# EAGLE design M622A (EAGLE 6.6.0)
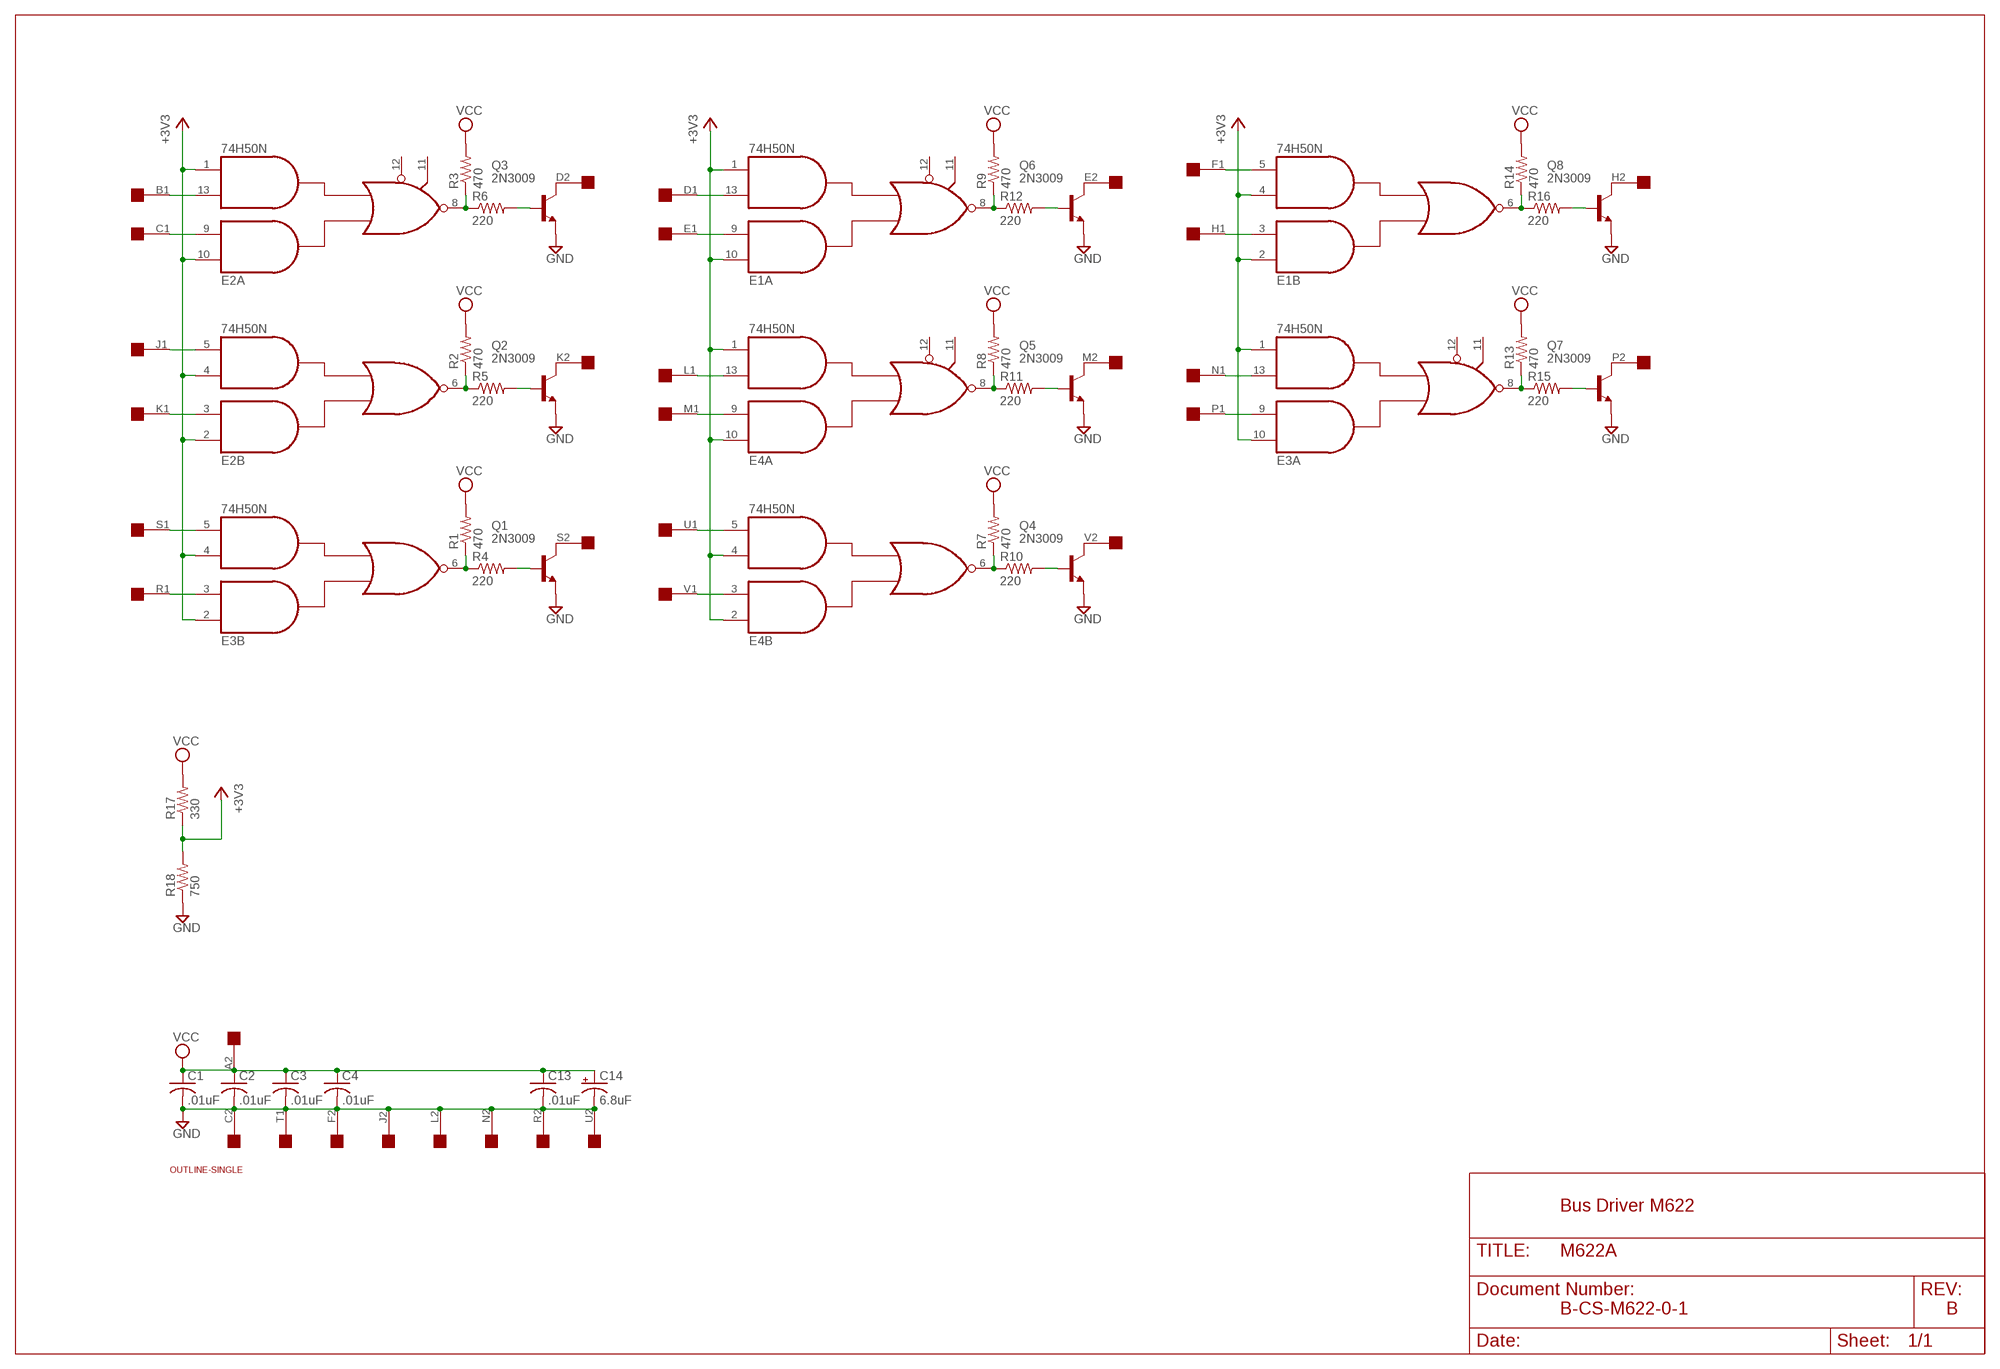
[diagram p0: schematic, sheet 1]

## Parts
C1  .01uF  C-US050-025X075  [C050-025X075]
C2  .01uF  C-US050-025X075  [C050-025X075]
C3  .01uF  C-US050-025X075  [C050-025X075]
C4  .01uF  C-US050-025X075  [C050-025X075]
C13  .01uF  C-US050-025X075  [C050-025X075]
C14  6.8uF  CPOL-USE20-8AXIAL  [E12-8]
E1  74H50N  7450N  [DIL14]
E2  74H50N  7450N  [DIL14]
E3  74H50N  7450N  [DIL14]
E4  74H50N  7450N  [DIL14]
Q1  2N3009  2N2102  [TO5]
Q2  2N3009  2N2102  [TO5]
Q3  2N3009  2N2102  [TO5]
Q4  2N3009  2N2102  [TO5]
Q5  2N3009  2N2102  [TO5]
Q6  2N3009  2N2102  [TO5]
Q7  2N3009  2N2102  [TO5]
Q8  2N3009  2N2102  [TO5]
R1  470  R-US_0207/10  [0207/10]
R2  470  R-US_0207/10  [0207/10]
R3  470  R-US_0207/10  [0207/10]
R4  220  R-US_0207/10  [0207/10]
R5  220  R-US_0207/10  [0207/10]
R6  220  R-US_0207/10  [0207/10]
R7  470  R-US_0207/10  [0207/10]
R8  470  R-US_0207/10  [0207/10]
R9  470  R-US_0207/10  [0207/10]
R10  220  R-US_0207/10  [0207/10]
R11  220  R-US_0207/10  [0207/10]
R12  220  R-US_0207/10  [0207/10]
R13  470  R-US_0207/10  [0207/10]
R14  470  R-US_0207/10  [0207/10]
R15  220  R-US_0207/10  [0207/10]
R16  220  R-US_0207/10  [0207/10]
R17  330  R-US_0207/10  [0207/10]
R18  750  R-US_0207/10  [0207/10]
U$1  SINGLE  [EDGE-CON2]
U$4  OUTLINE-SINGLE  [SINGLE]

## Nets
+3V3 [Supply]: E1.1(A:I4) E1.2(B:I1) E1.4(B:I3) E1.10(A:I1) E2.1(A:I4) E2.2(B:I1) E2.4(B:I3) E2.10(A:I1) E3.1(A:I4) E3.2(B:I1) E3.4(B:I3) E3.10(A:I1) E4.1(A:I4) E4.2(B:I1) E4.4(B:I3) E4.10(A:I1) R17.1 R18.2
GND [Supply]: C1.2 C2.2 C3.2 C4.2 C13.2 C14.- Q1.1(E) Q2.1(E) Q3.1(E) Q4.1(E) Q5.1(E) Q6.1(E) Q7.1(E) Q8.1(E) R18.1 U$1.C2 U$1.F2 U$1.J2 U$1.L2 U$1.N2 U$1.R2 U$1.T1 U$1.U2
N$1: E2.3(B:I2) U$1.K1
N$2: E2.5(B:I4) U$1.J1
N$3: E2.9(A:I2) U$1.C1
N$4: E2.13(A:I3) U$1.B1
N$5: E3.5(B:I4) U$1.S1
N$6: E3.3(B:I2) U$1.R1
N$7: E2.8(A:O) R3.1 R6.1
N$8: Q3.2(B) R6.2
N$9: E1.8(A:O) R9.1 R12.1
N$10: Q6.2(B) R12.2
N$11: Q3.3(C) U$1.D2
N$12: E2.6(B:O) R2.1 R5.1
N$13: Q6.3(C) U$1.E2
N$14: E4.3(B:I2) U$1.V1
N$15: E4.5(B:I4) U$1.U1
N$16: E4.13(A:I3) U$1.L1
N$17: E4.9(A:I2) U$1.M1
N$18: Q2.2(B) R5.2
N$19: E1.6(B:O) R14.1 R16.1
N$20: Q8.2(B) R16.2
N$21: E4.8(A:O) R8.1 R11.1
N$22: Q5.2(B) R11.2
N$23: E3.8(A:O) R13.1 R15.1
N$24: Q7.2(B) R15.2
N$25: E3.6(B:O) R1.1 R4.1
N$26: Q1.2(B) R4.2
N$27: E4.6(B:O) R7.1 R10.1
N$28: Q4.2(B) R10.2
N$29: E1.13(A:I3) U$1.D1
N$30: E1.9(A:I2) U$1.E1
N$31: Q5.3(C) U$1.M2
N$32: Q4.3(C) U$1.V2
N$33: E1.5(B:I4) U$1.F1
N$34: E3.9(A:I2) U$1.P1
N$35: E3.13(A:I3) U$1.N1
N$36: E1.3(B:I2) U$1.H1
N$37: Q8.3(C) U$1.H2
N$38: Q7.3(C) U$1.P2
N$39: Q1.3(C) U$1.S2
N$40: Q2.3(C) U$1.K2
VCC [Supply]: C1.1 C2.1 C3.1 C4.1 C13.1 C14.+ R1.2 R2.2 R3.2 R7.2 R8.2 R9.2 R13.2 R14.2 R17.2 U$1.A2
Unconnected: E1.11(A:I6) E1.12(A:I5) E2.11(A:I6) E2.12(A:I5) E3.11(A:I6) E3.12(A:I5) E4.11(A:I6) E4.12(A:I5) U$1.A1 U$1.B2 U$1.T2

## Notes on the sheet
- Bus Driver M622
- B-CS-M622-0-1 | B

## Power pins joined to a net without a drawn wire
GND: E1.7(P:GND) E2.7(P:GND) E3.7(P:GND) E4.7(P:GND)
VCC: E1.14(P:VCC) E2.14(P:VCC) E3.14(P:VCC) E4.14(P:VCC)

## Library data of the parts
C1-C4 C13 = rcl:C-US: CAPACITOR, American symbol
C14 = dec-con:CPOL-USE20-8AXIAL: A 0.8 inch electrolytic.
E1-E4 = dec-con:74*50: 4-2-3-2 input AND OR INVERTER gates
Q1-Q8 = transistor-npn:2N2102: NPN Transistor
R1-R18 = rcl:R-US_: RESISTOR, American symbol
U$1 = dec-con:SINGLE: Single-Height DEC board
U$4 = dec-con:OUTLINE-*: Board outlines for DEC boards.

## Net classes
1 Supply: width 0.813 mm

## Board
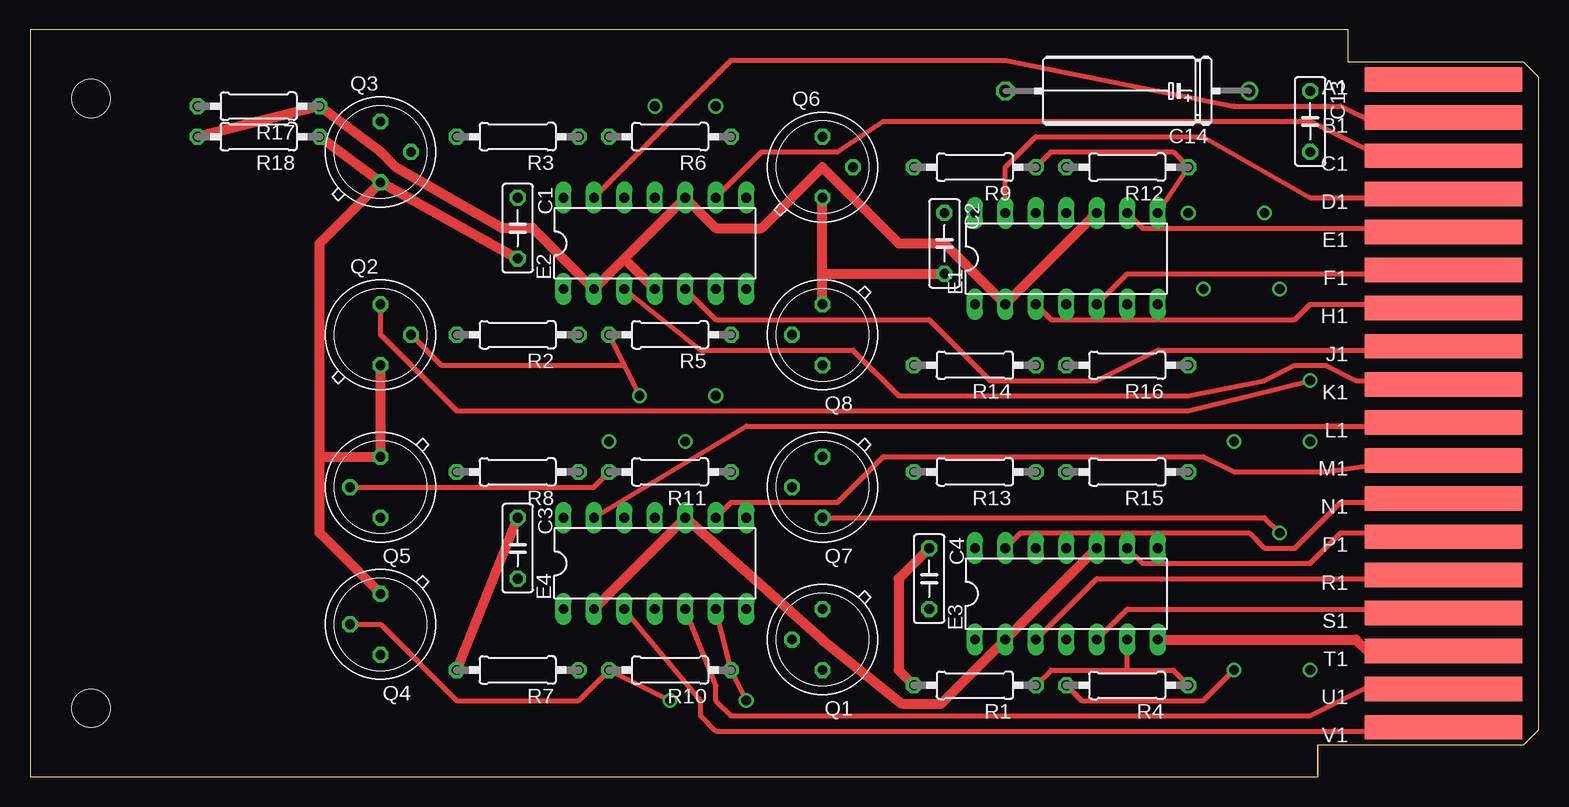
[diagram p1: board, top side]
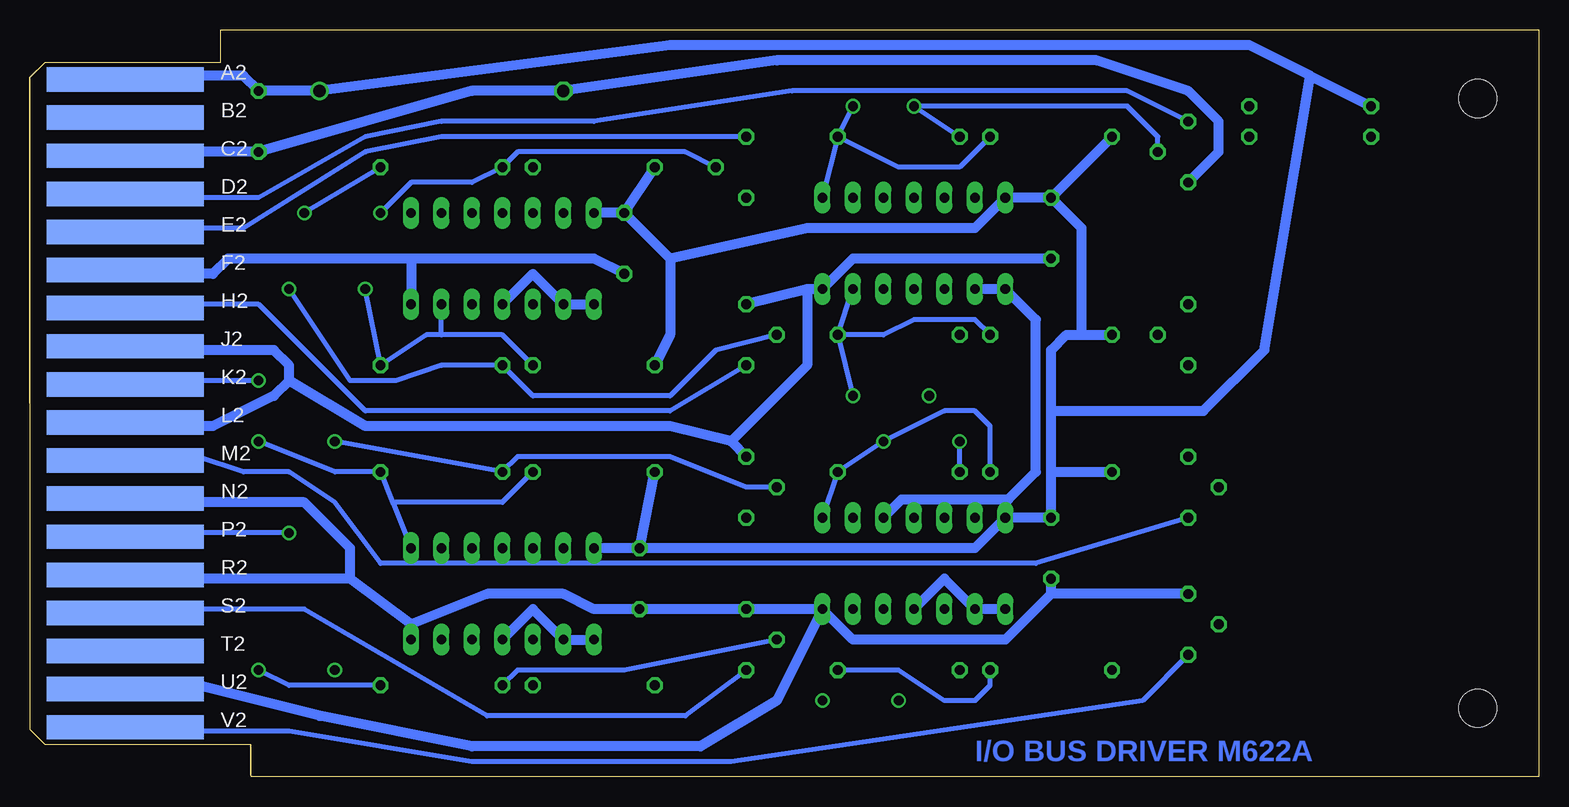
[diagram p2: board, bottom side, seen from below]

Size 125.73 x 62.23 mm. Coordinates in mm from the lower left corner, seen from the top.
Copper layers (1+16): Top 0.035mm / dielectric 1.5mm / Bottom 0.035mm
Design rules "16mils": minimum track width 16mil, minimum drill 32mil, track to track 15mil, track to pad 10mil, pad to pad 10mil, via to via 10mil, smd to smd 10mil, copper to edge 13mil, drill to drill 10mil, minimum pad ring 10mil, minimum via ring 8mil, stop-mask expansion 0mil, vias tented up to drill 0mil, thermal gap 10mil

### Footprints (pad centres in the part's own frame; a part is rotated, then mirrored left to right if it is on the bottom)
C050-025X075 = drill 0.813 octagon: 1 -2.54,0; 2 2.54,0
E12-8 = drill 1.016: + -10.16,0 | drill 1.016 octagon: - 10.16,0
DIL14 = drill 0.813 long: 1 -7.62,-3.81; 2 -5.08,-3.81; 3 -2.54,-3.81; 4 0,-3.81; 5 2.54,-3.81; 6 5.08,-3.81; 7 7.62,-3.81; 8 7.62,3.81; 9 5.08,3.81; 10 2.54,3.81; 11 0,3.81; 12 -2.54,3.81; 13 -5.08,3.81; 14 -7.62,3.81
TO5 = drill 0.813 octagon: 1 0,-2.54; 2 2.54,0; 3 0,2.54
0207/10 = drill 0.813 octagon: 1 -5.08,0; 2 5.08,0
EDGE-CON2 = smd 13.106 x 2.032: A1 7.938,4.128; B1 7.938,7.303; C1 7.938,10.477; D1 7.938,13.652; E1 7.938,16.828; F1 7.938,20.003; H1 7.938,23.177; J1 7.938,26.352; K1 7.938,29.527; L1 7.938,32.703; M1 7.938,35.877; N1 7.938,39.053; P1 7.938,42.227; R1 7.938,45.403; S1 7.938,48.578; T1 7.938,51.752; U1 7.938,54.928; V1 7.938,58.102 | smd 13.106 x 2.032 bottom: A2 7.938,4.128; B2 7.938,7.303; C2 7.938,10.477; D2 7.938,13.652; E2 7.938,16.828; F2 7.938,20.003; H2 7.938,23.177; J2 7.938,26.352; K2 7.938,29.527; L2 7.938,32.703; M2 7.938,35.877; N2 7.938,39.053; P2 7.938,42.227; R2 7.938,45.403; S2 7.938,48.578; T2 7.938,51.752; U2 7.938,54.928; V2 7.938,58.102
SINGLE = hole 3.175: 120.65,56.515; 120.65,5.715

### Placement (x,y rotation side)
C1  40.64,45.72 270 top
C2  76.2,44.45 270 top
C3  40.64,19.05 270 top
C4  74.93,16.51 270 top
C13  106.68,54.61 270 top
C14  91.44,57.15 180 top
E1  86.36,43.18 0 top
E2  52.07,44.45 0 top
E3  86.36,15.24 0 top
E4  52.07,17.78 0 top
Q1  66.04,11.43 180 top
Q2  29.21,36.83 0 top
Q3  29.21,52.07 0 top
Q4  29.21,12.7 180 top
Q5  29.21,24.13 180 top
Q6  66.04,50.8 0 top
Q7  66.04,24.13 180 top
Q8  66.04,36.83 180 top
R1  78.74,7.62 180 top
R2  40.64,36.83 180 top
R3  40.64,53.34 180 top
R4  91.44,7.62 180 top
R5  53.34,36.83 180 top
R6  53.34,53.34 180 top
R7  40.64,8.89 180 top
R8  40.64,25.4 180 top
R9  78.74,50.8 180 top
R10  53.34,8.89 180 top
R11  53.34,25.4 180 top
R12  91.44,50.8 180 top
R13  78.74,25.4 180 top
R14  78.74,34.29 180 top
R15  91.44,25.4 180 top
R16  91.44,34.29 180 top
R17  19.05,55.88 180 top
R18  19.05,53.34 180 top
U$1  125.73,62.23 180 top
U$4  125.73,62.23 180 top

### Tracks (layer width: path | path; a pad name or v marks a point on that pad's centre or on a via)
+3V3
  Top 0.813: R18.2 R17.1 29.21,52.07 30.48,50.8 39.37,45.72 41.91,45.72 E2.2 49.53,43.18 | 49.53,43.18 E2.4 | E3.10 E3.2 75.95,6.1 72.64,6.1 66.04,11.43 E4.10 E4.2 | E1.10 E1.2 76.2,44.45 72.39,44.45 66.04,50.8 60.96,45.72 57.15,45.72 E2.10 49.53,43.18
  Bottom 0.813: E4.1 E4.2 49.53,16.51 E4.4 | E2.2 E2.1 41.91,38.1 41.91,25.4 44.2,23.11 53.09,23.11 E4.10 | E3.1 E3.2 83.82,13.97 E3.4 | E1.1 E1.2 83.82,41.91 E1.4
GND
  Top 0.813: U$1.T1 116.84,10.16 111.76,10.16 110.49,11.43 E3.7 | Q4.1 24.13,20.32 24.13,26.67 | 24.13,26.67 24.13,44.45 Q3.1 | 66.04,41.91 C2.2 | 66.04,41.91 Q6.1 | Q8.1 66.04,41.91 | 24.13,26.67 Q5.1 Q2.1 | Q3.1 C1.2 | Q3.1 R18.1
  Bottom 0.813: U$1.C2 117.17,51.74 116.84,52.07 C13.2 88.9,57.15 C14.- 63.5,59.69 36.83,59.69 29.21,57.15 26.67,54.61 26.67,52.07 Q3.1 | Q4.1 40.64,15.24 | 40.64,15.24 C3.2 | 40.64,15.24 44.45,11.43 57.15,11.43 E4.7 | U$1.U2 117.2,7.26 116.84,7.62 111.76,7.62 101.6,5.08 88.9,2.54 69.85,2.54 63.5,6.35 E4.7 | 93.98,12.7 87.63,15.24 81.28,15.24 78.74,13.97 C4.2 Q1.1 E4.7 | U$1.R2 116.84,16.51 99.06,16.51 | 93.98,12.7 99.06,16.51 | U$1.N2 116.84,22.86 102.87,22.86 99.06,19.05 99.06,16.51 | U$1.J2 116.84,35.56 105.41,35.56 104.14,34.29 104.14,33.02 | 104.14,33.02 105.41,31.75 110.49,29.21 116.84,29.21 U$1.L2 | 67.31,27.94 72.39,29.21 97.79,29.21 104.14,33.02 | 60.96,40.64 60.96,34.29 67.31,27.94 | C1.2 57.15,43.18 E2.7 60.96,40.64 | U$1.F2 116.84,41.91 110.49,41.91 109.22,43.18 93.98,43.18 | C2.2 78.74,43.18 93.98,43.18 | 60.96,40.64 Q8.1 | 93.98,43.18 E1.7 | 93.98,12.7 E3.7 | 67.31,27.94 Q7.1
N$1
  Top 0.406: E2.3 55.88,35.56 68.58,35.56 72.39,31.75 96.52,31.75 102.87,33.02 105.41,34.29 107.95,34.29 110.49,33.02 116.84,33.02 U$1.K1
N$2
  Top 0.406: E2.5 57.15,38.1 74.93,38.1 80.01,33.02 88.9,33.02 93.98,35.56 116.84,35.56 U$1.J1
N$3
  Top 0.406: E2.9 60.96,52.07 67.31,52.07 71.12,54.61 106.68,54.61 111.76,52.07 116.84,52.07 U$1.C1
N$4
  Top 0.406: U$1.B1 116.84,54.61 111.76,54.61 109.22,55.88 100.33,55.88 81.28,59.69 58.42,59.69 E2.13
N$5
  Top 0.406: U$1.S1 116.84,13.97 91.44,13.97 E3.5
N$6
  Top 0.406: U$1.R1 116.84,16.51 88.9,16.51 E3.3
N$7  (via drill 0.81)
  Bottom 0.406: R3.1 48.26,50.8 53.34,50.8 R6.1 | R6.1 E2.8 | R6.1 v57.15,55.88
N$8  (via drill 0.81)
  Bottom 0.406: R6.2 v52.07,55.88 34.29,55.88 31.75,53.34 Q3.2
N$9  (via drill 0.81)
  Top 0.406: R9.1 85.09,52.07 95.25,52.07 R12.1 E1.8
  Bottom 0.406: R12.1 v102.87,46.99
N$10  (via drill 0.81)
  Bottom 0.406: Q6.2 71.12,52.07 85.09,52.07 R12.2 88.9,49.53 93.98,49.53 v96.52,46.99
N$11
  Bottom 0.406: Q3.3 34.29,57.15 62.23,57.15 78.74,54.61 91.44,54.61 97.79,53.34 106.68,48.26 116.84,48.26 U$1.D2
N$12  (via drill 0.81)
  Bottom 0.406: R2.1 46.99,38.1 52.07,38.1 54.61,36.83 R5.1 | R5.1 E2.6 | R5.1 v57.15,31.75
N$13
  Bottom 0.406: Q6.3 91.44,53.34 97.79,52.07 107.95,45.72 116.84,45.72 U$1.E2
N$14
  Top 0.406: E4.3 55.88,6.35 55.88,5.08 57.15,3.81 116.84,3.81 U$1.V1
N$15
  Top 0.406: E4.5 57.15,7.62 57.15,6.35 58.42,5.08 106.68,5.08 111.76,7.62 116.84,7.62 U$1.U1
N$16
  Top 0.406: E4.13 59.69,29.21 109.22,29.21 | 109.22,29.21 107.95,29.21 | U$1.L1 116.84,29.21 109.22,29.21
N$17
  Top 0.406: E4.9 58.42,22.86 67.31,22.86 71.12,26.67 97.79,26.67 100.33,25.4 107.95,25.4 116.84,26.67 U$1.M1
N$18  (via drill 0.81)
  Top 0.406: 49.53,34.29 v50.8,31.75 | 49.53,34.29 R5.2 | Q2.2 34.29,34.29 49.53,34.29
N$19  (via drill 0.81)
  Bottom 0.406: v97.79,40.64 R16.1 92.71,36.83 91.44,36.83 | R14.1 86.36,36.83 91.44,36.83 | 91.44,36.83 E1.6
N$20  (via drill 0.81)
  Bottom 0.406: v104.14,40.64 99.06,33.02 95.25,33.02 91.44,34.29 R16.2 83.82,31.75 72.39,31.75 68.58,35.56 Q8.2
N$21  (via drill 0.81)
  Bottom 0.406: R8.1 45.72,29.21 46.99,30.48 49.53,30.48 v54.61,27.94 R11.1 E4.8
N$22  (via drill 0.81)
  Top 0.406: Q5.2 46.99,24.13 R11.2
  Bottom 0.406: R11.2 v48.26,27.94
N$23  (via drill 0.81)
  Bottom 0.406: 95.47,22.77 E3.8 | 95.47,22.77 R15.1 100.33,25.4 v106.68,27.94 | R13.1 86.36,22.86 95.25,22.86 95.47,22.77
N$24  (via drill 0.81)
  Bottom 0.406: v100.33,27.94 R15.2 85.09,26.67 72.39,26.67 66.04,24.13 Q7.2
N$25  (via drill 0.81)
  Top 0.406: R1.1 85.09,8.89 91.44,8.89 | 91.44,8.89 95.25,8.89 R4.1 | 91.44,8.89 E3.6
  Bottom 0.406: R4.1 104.14,7.62 v106.68,8.89
N$26  (via drill 0.81)
  Top 0.406: R4.2 87.63,6.35 97.79,6.35 v100.33,8.89
  Bottom 0.406: Q1.2 76.2,8.89 85.09,8.89 R4.2
N$27  (via drill 0.81)
  Top 0.406: v59.69,6.35 R10.1 E4.6
  Bottom 0.406: R7.1 45.72,7.62 46.99,6.35 49.53,6.35 53.34,8.89 R10.1
N$28  (via drill 0.81)
  Top 0.406: v53.34,6.35 R10.2 45.72,6.35 35.56,6.35 29.21,12.7 Q4.2
N$29
  Top 0.406: E1.13 81.28,50.8 83.82,53.34 97.79,53.34 106.68,48.26 116.84,48.26 U$1.D1
N$30
  Top 0.406: U$1.E1 116.84,45.72 92.71,45.72 E1.9
N$31
  Bottom 0.406: Q5.3 41.91,17.78 96.52,17.78 100.33,22.86 104.14,25.4 107.95,25.4 111.76,26.67 116.84,26.67 U$1.M2
N$32
  Bottom 0.406: U$1.V2 117.23,4.2 116.84,3.81 104.14,3.81 88.9,1.27 67.31,1.27 33.02,6.35 Q4.3
N$33
  Top 0.406: U$1.F1 116.84,41.91 91.44,41.91 E1.5
N$34
  Top 0.406: U$1.P1 116.84,20.32 109.22,20.32 106.68,17.78 92.71,17.78 E3.9
N$35
  Top 0.406: E3.13 82.55,20.32 101.6,20.32 102.87,19.05 105.41,19.05 109.22,22.86 116.84,22.86 U$1.N1
N$36
  Top 0.406: U$1.H1 116.84,39.37 106.68,39.37 105.41,38.1 85.09,38.1 E1.3
N$37
  Bottom 0.406: Q8.3 72.39,30.48 97.79,30.48 106.68,39.37 116.84,39.37 U$1.H2
N$38  (via drill 0.81)
  Top 0.406: Q7.3 102.87,21.59 v104.14,20.32
  Bottom 0.406: U$1.P2 116.84,20.32 v104.14,20.32
N$39
  Bottom 0.406: Q1.3 71.12,5.08 87.63,5.08 102.87,13.97 116.84,13.97 U$1.S2
N$40  (via drill 0.81)
  Top 0.406: Q2.3 29.21,36.83 35.56,30.48 96.52,30.48 v106.68,33.02
  Bottom 0.406: U$1.K2 116.84,33.02 v106.68,33.02
VCC
  Top 0.813: R1.2 72.39,8.89 72.39,16.51 C4.1 | R7.2 C3.1
  Bottom 0.813: U$1.A2 117.24,58.02 116.84,58.42 107.95,58.42 C13.1 C14.+ 72.39,60.96 24.13,60.96 19.05,58.42 | 19.05,58.42 R17.2 | 40.64,25.4 C3.1 E4.14 46.99,19.05 C4.1 | 38.1,36.83 39.37,36.83 40.64,35.56 40.64,30.48 | 40.64,25.4 40.64,30.48 | C1.1 38.1,45.72 38.1,36.83 | 40.64,30.48 27.94,30.48 22.86,35.56 19.05,58.42 | 72.39,43.18 72.39,36.83 R14.2 | 72.39,43.18 60.96,45.72 46.99,45.72 E2.14 C1.1 | 72.39,43.18 C2.1 | C2.1 R9.2 | C2.1 E1.14 | C4.1 R13.2 | C4.1 E3.14 | C1.1 R3.2 | 40.64,25.4 R8.2 | 38.1,36.83 R2.2

### Text on the board
Bottom: I/O BUS DRIVER M622A